# Altium project 语音识别.PrjPcb
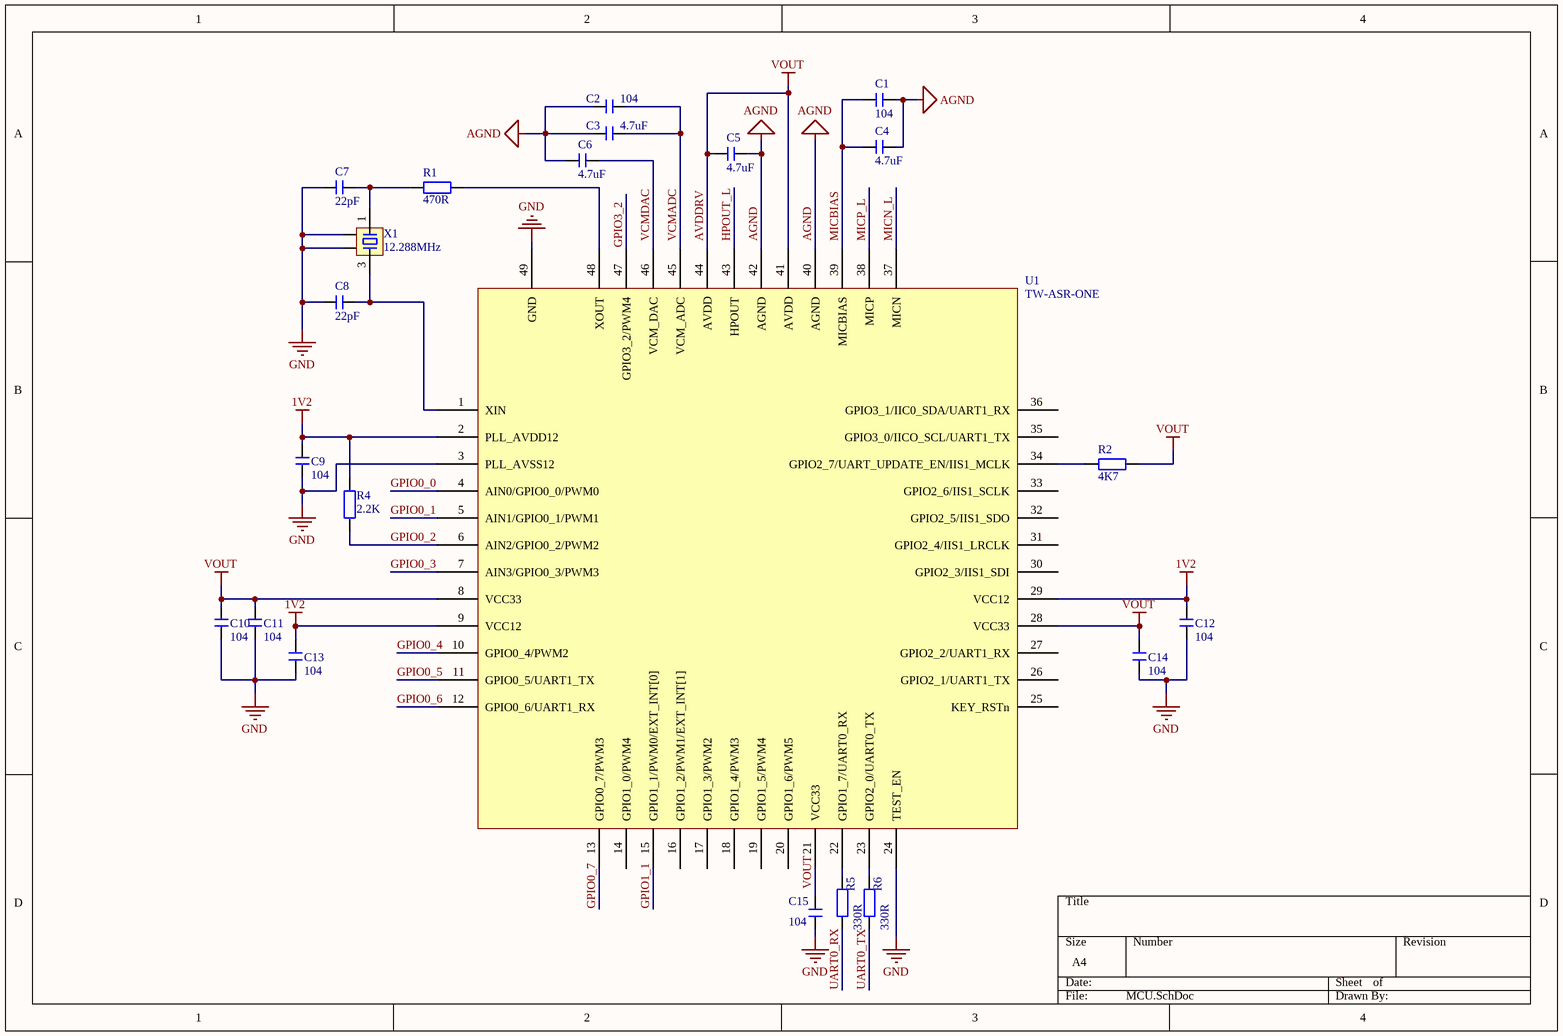
[diagram p0: MCU.SchDoc]
2 sheets, 70 parts. Net scope: global (net labels, ports and power ports of the same name join across sheets).
Board file: PCB.PcbDoc
Sheets:
  MCU.SchDoc
  OTHER.SchDoc

## Sheet MCU.SchDoc
size A4; SheetNumber: 1; SheetTotal: 2

### Parts
C1  104  [C 0603_L]
C2  104  [C 0603_L]
C3  4.7uF  [C 0603_L]
C4  4.7uF  [C 0603_L]
C5  4.7uF  [C 0603_L]
C6  4.7uF  [C 0603_L]
C7  22pF  [C 0603_L]
C8  22pF  [C 0603_L]
C9  104  [C 0603_L]
C10  104  [C 0603_L]
C11  104  [C 0603_L]
C12  104  [C 0603_L]
C13  104  [C 0603_L]
C14  104  [C 0603_L]
C15  104  [C 0603_L]
R1  470R  [R 0603_L]
R2  4K7  [R 0603_L]
R4  2.2K  [R 0603_L]
R5  330R  [R 0603_L]
R6  330R  [R 0603_L]
U1  TW-ASR-ONE  [QFN48 6X6]
X1  12.288MHz  [OSC 3225-4P]

### Nets
1V2: C9.2 C12.2 C13.2 R4.2 U1.2(PLL_AVDD12) U1.9(VCC12) U1.29(VCC12)
AGND: C1.2 C2.1 C3.1 C4.2 C5.2 C6.1 U1.40(AGND) U1.42(AGND)
AVDDRV: C5.1 C10.2 C11.2 C14.2 C15.2 R2.2 U1.8(VCC33) U1.21(VCC33) U1.28(VCC33) U1.41(AVDD) U1.44(AVDD)  [also labelled VOUT]
GND: C7.1 C8.1 C9.1 C10.1 C11.1 C12.1 C13.1 C14.1 C15.1 U1.3(PLL_AVSS12) U1.24(TEST_EN) U1.49(GND) X1.2 X1.4
GPIO0_0: U1.4(AIN0/GPIO0_0/PWM0)
GPIO0_1: U1.5(AIN1/GPIO0_1/PWM1)
GPIO0_2: R4.1 U1.6(AIN2/GPIO0_2/PWM2)
GPIO0_3: U1.7(AIN3/GPIO0_3/PWM3)
GPIO0_4: U1.10(GPIO0_4/PWM2)
GPIO0_5: U1.11(GPIO0_5/UART1_TX)
GPIO0_6: U1.12(GPIO0_6/UART1_RX)
GPIO0_7: U1.13(GPIO0_7/PWM3)
GPIO1_1: U1.15(GPIO1_1/PWM0/EXT_INT[0])
GPIO3_2: U1.47(GPIO3_2/PWM4)
HPOUT_L: U1.43(HPOUT)
MICBIAS: C1.1 C4.1 U1.39(MICBIAS)
MICN_L: U1.37(MICN)
MICP_L: U1.38(MICP)
UART0_RX: R5.1
UART0_TX: R6.1
VCMADC: C2.2 C3.2 U1.45(VCM_ADC)
VCMDAC: C6.2 U1.46(VCM_DAC)
NetC7_2: C7.2 R1.1 X1.1
NetC8_2: C8.2 U1.1(XIN) X1.3
NetR1_2: R1.2 U1.48(XOUT)
NetR2_1: R2.1 U1.34(GPIO2_7/UART_UPDATE_EN/IIS1_MCLK)
NetR5_2: R5.2 U1.22(GPIO1_7/UART0_RX)
NetR6_2: R6.2 U1.23(GPIO2_0/UART0_TX)

Not connected (* = marked no-connect by the designer): U1 14(GPIO1_0/PWM4) 16(GPIO1_2/PWM1/EXT_INT[1]) 17(GPIO1_3/PWM2) 18(GPIO1_4/PWM3) 19(GPIO1_5/PWM4) 20(GPIO1_6/PWM5) 25(KEY_RSTn) 26(GPIO2_1/UART1_TX) 27(GPIO2_2/UART1_RX) 30(GPIO2_3/IIS1_SDI) 31(GPIO2_4/IIS1_LRCLK) 32(GPIO2_5/IIS1_SDO) 33(GPIO2_6/IIS1_SCLK) 35(GPIO3_0/IICO_SCL/UART1_TX) 36(GPIO3_1/IIC0_SDA/UART1_RX)

### Library data of the parts
C1-C15 = C: 无极性贴片电容; 版权归属: 源创客; BOM名称: 无极性贴片电容; 学习资源: www.ooocke.com
R1 R2 R4-R6 = R: 贴片电阻; 版权归属: 源创客; BOM名称: 贴片电阻; 学习资源: www.ooocke.com
X1 = XTAL-4P: 4脚无源晶振; 版权归属: 源创客; BOM名称: 4脚无源晶振; 学习资源: www.ooocke.com

## Sheet OTHER.SchDoc
size A4; SheetNumber: 2; SheetTotal: 2
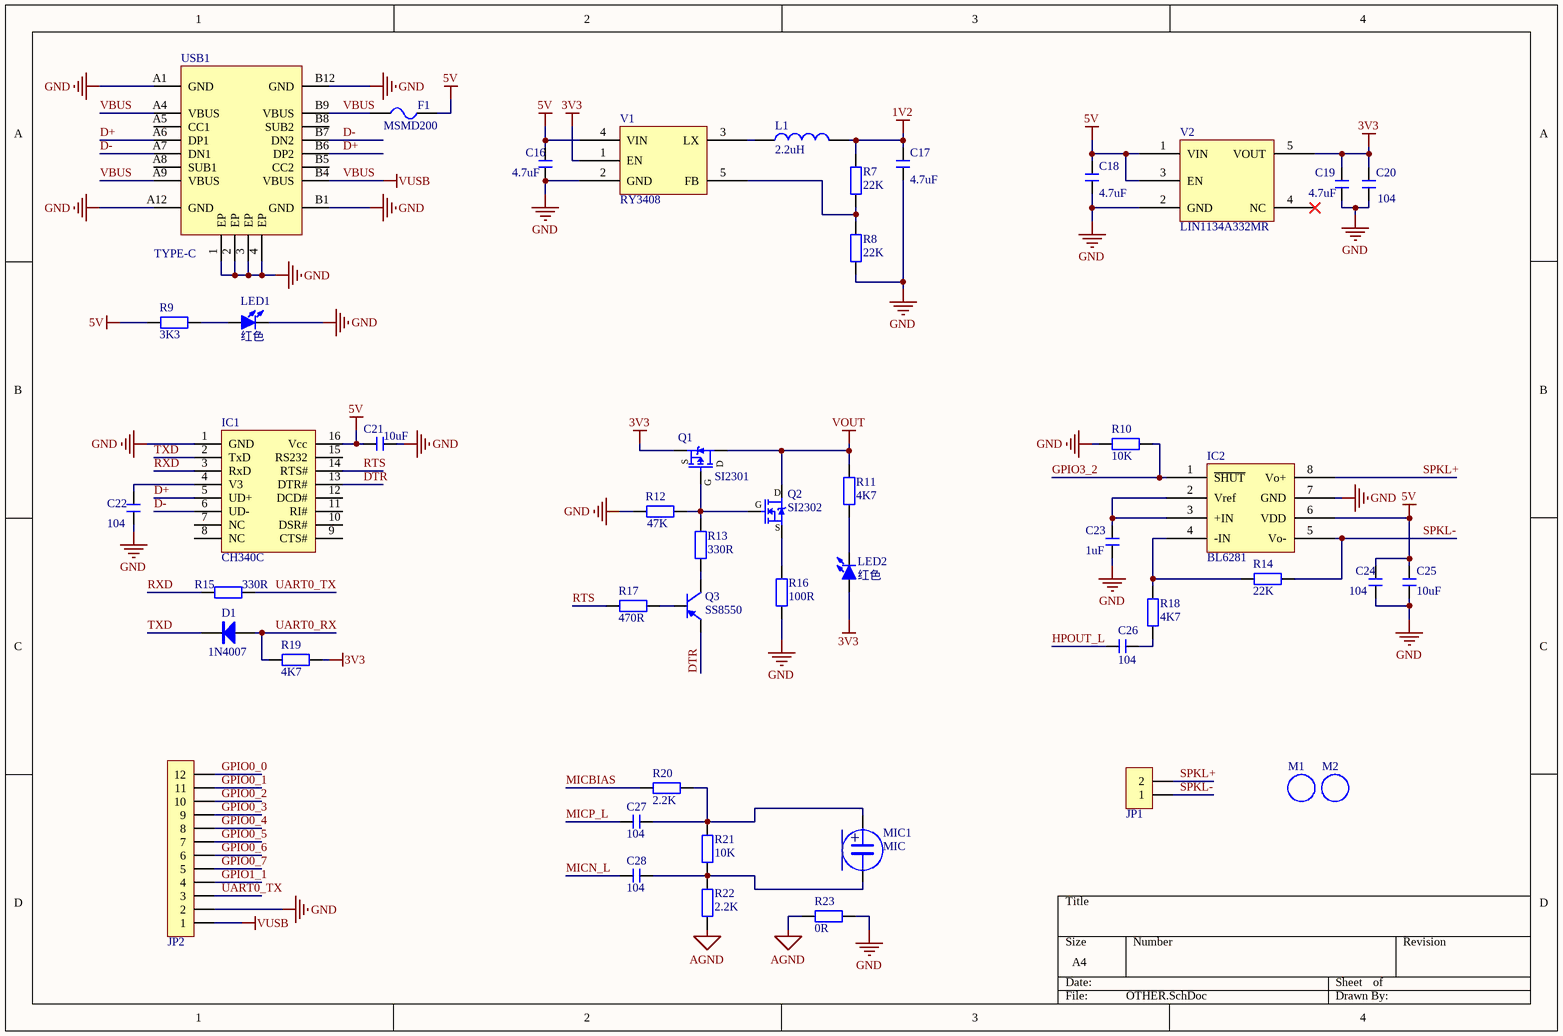
[diagram p1: OTHER.SchDoc]

### Parts
C16  4.7uF  [C 0603_L]
C17  4.7uF  [C 0603_L]
C18  4.7uF  [C 0603_L]
C19  4.7uF  [C 0603_L]
C20  104  [C 0603_L]
C21  10uF  [C 0805_L]
C22  104  [C 0603_L]
C23  1uF  [C 0603_L]
C24  104  [C 0603_L]
C25  10uF  [C 0603_L]
C26  104  [C 0603_L]
C27  104  [C 0603_L]
C28  104  [C 0603_L]
D1  1N4007  [SOD-123]
F1  MSMD200  [FU 0805]
IC1  CH340C  [SOP16_L]
IC2  BL6281  [SOP8_L]
JP1  HDR-1X2  [PH2.0-WS-2P]  (value not drawn)
JP2  HDR-1X12  [HDR2.54-LI-12P]  (value not drawn)
L1  2.2uH  [L 0805]
LED1  红色  [LED 0603R]
LED2  红色  [LED 0603R]
M1  (no value)  [M3 125X200]
M2  (no value)  [M3 125X200]
MIC1  MIC  [MIC-6*2.7]
Q1  SI2301  [SOT23-3N]
Q2  SI2302  [SOT23-3N]
Q3  SS8550  [SOT23-3N]
R7  22K  [R 0603_L]
R8  22K  [R 0603_L]
R9  3K3  [R 0603_L]
R10  10K  [R 0603_L]
R11  4K7  [R 0603_L]
R12  47K  [R 0603_L]
R13  330R  [R 0603_L]
R14  22K  [R 0603_L]
R15  330R  [R 0603_L]
R16  100R  [R 0603_L]
R17  470R  [R 0603_L]
R18  4K7  [R 0603_L]
R19  4K7  [R 0603_L]
R20  2.2K  [R 0603_L]
R21  10K  [R 0603_L]
R22  2.2K  [R 0603_L]
R23  0R  [R 0603_L]
USB1  TYPE-C  [TYPE-C_16P]
V1  RY3408  [SOT23-5N]
V2  LIN1134A332MR  [SOT23-5L]

### Nets
1V2: C17.2 L1.2 R7.2
3V3: C19.2 C20.2 LED2.1(A) Q1.2(S) R19.1 V1.1(EN) V2.5(VOUT)
5V: C16.2 C18.2 C21.2 C24.1 C25.2 F1.2 IC1.16(Vcc) IC2.6(VDD) R9.1 V1.4(VIN) V2.1(VIN) V2.3(EN)
AGND: R22.2 R23.1
GND: C16.1 C17.1 C18.1 C19.1 C20.1 C21.1 C22.1 C23.1 C24.2 C25.1 IC1.1(GND) IC2.7(GND) JP2.2 LED1.2(K) R8.1 R10.2 R12.2 R16.2 R23.2 USB1.1(EP) USB1.2(EP) USB1.3(EP) USB1.4(EP) USB1.A1(GND) USB1.A12(GND) USB1.B1(GND) USB1.B12(GND) V1.2(GND) V2.2(GND)
VBUS: F1.1 JP2.1 USB1.A4(VBUS) USB1.A9(VBUS) USB1.B4(VBUS) USB1.B9(VBUS)  [also labelled VUSB]
VOUT: Q1.3(D) Q2.3(D) R11.2  [project net AVDDRV]
D+: IC1.5(UD+) USB1.A6(DP1) USB1.B6(DP2)
D-: IC1.6(UD-) USB1.A7(DN1) USB1.B7(DN2)
DTR: IC1.13(DTR#) Q3.2(E)
GPIO0_0: JP2.12
GPIO0_1: JP2.11
GPIO0_2: JP2.10
GPIO0_3: JP2.9
GPIO0_4: JP2.8
GPIO0_5: JP2.7
GPIO0_6: JP2.6
GPIO0_7: JP2.5
GPIO1_1: JP2.4
GPIO3_2: IC2.1(~{SHUT}) R10.1
HPOUT_L: C26.2
MICBIAS: R20.1
MICN_L: C28.1
MICP_L: C27.1
RTS: IC1.14(RTS#) R17.2
RXD: IC1.3(RxD) R15.1
SPKL+: IC2.8(Vo+) JP1.2
SPKL-: IC2.5(Vo-) JP1.1 R14.1
TXD: D1.2(K) IC1.2(TxD)
UART0_RX: D1.1(A) R19.2
UART0_TX: JP2.3 R15.2
NetC22_2: C22.2 IC1.4(V3)
NetC23_2: C23.2 IC2.2(Vref) IC2.3(+IN)
NetC26_1: C26.1 R18.2
NetC27_2: C27.2 MIC1.1 R20.2 R21.1
NetC28_2: C28.2 MIC1.2 R21.2 R22.1
NetIC2_4: IC2.4(-IN) R14.2 R18.1
NetL1_1: L1.1 V1.3(LX)
NetLED1_1: LED1.1(A) R9.2
NetLED2_2: LED2.2(K) R11.1
NetQ1_1: Q1.1(G) Q2.1(G) R12.1 R13.2
NetQ2_2: Q2.2(S) R16.1
NetQ3_1: Q3.1(B) R17.1
NetQ3_3: Q3.3(C) R13.1
NetR7_1: R7.1 R8.2 V1.5(FB)

Not connected (* = marked no-connect by the designer): IC1 7(NC) 8(NC) 9(CTS#) 10(DSR#) 11(RI#) 12(DCD#) 15(RS232); USB1 A5(CC1) A8(SUB1) B5(CC2) B8(SUB2); V2 4(NC)*

### Notes on the sheet
- (in symbol MIC3) +

### Library data of the parts
C16-C28 = C: 无极性贴片电容; 版权归属: 源创客; BOM名称: 无极性贴片电容; 学习资源: www.ooocke.com
D1 = 1N4007: 整流二极管; 版权归属: 源创客; BOM名称: 整流二极管; 学习资源: www.ooocke.com
F1 = FU: 贴片保险丝; 版权归属: 源创客; BOM名称: 贴片保险丝; 学习资源: www.ooocke.com
IC1 = CH340G: 串口转USB; 版权归属: 源创客; BOM名称: 串口转USB; 学习资源: www.ooocke.com
IC2 = BL6281: 音频功放
JP1 = Header 2: 2P接插件; 版权归属: 源创客; BOM名称: 2P接插件; 学习资源: www.ooocke.com
JP2 = Header 12: 12P接插件; 版权归属: 源创客; BOM名称: 12P接插件; 学习资源: www.ooocke.com
L1 = L: 小功率贴片电感; 版权归属: 源创客; BOM名称: 小功率贴片电感; 学习资源: www.ooocke.com
LED1 LED2 = LED-SMD: 贴片LED; 版权归属: 源创客; BOM名称: 贴片LED; 学习资源: www.ooocke.com
M1 M2 = M3: 铜柱孔; 版权归属: 源创客; BOM名称: 铜柱孔; 学习资源: www.ooocke.com
MIC1 = MIC3: 麦克风
Q1 = SI2301: P沟道 20V/2.8A; BOM名称: 场效应管; 版权归属: 源创客; 学习资源: www.ooocke.com; 描述: P沟道 20V/2.8A
Q2 = SI2302: N沟道 20V/3A; BOM名称: 场效应管; 版权归属: 源创客; 学习资源: www.ooocke.com; 描述: N沟道 20V/3A
Q3 = 8550-SMD: 高频放大-PNP型; 版权归属: 源创客; 属性: 40V 1.5A 1W 100MHZ; BOM名称: 高频放大-PNP型; 学习资源: www.ooocke.com
R7-R23 = R: 贴片电阻; 版权归属: 源创客; BOM名称: 贴片电阻; 学习资源: www.ooocke.com
USB1 = TYPE-C_16P: 16脚TYPE-C母座
V1 = RY3408: DC电源芯片
V2 = LIN1134A332MR: DC稳压芯片

## Nets that join several sheets
1V2: MCU (7 pins), OTHER (C17.2 L1.2 R7.2)
AGND: MCU (8 pins), OTHER (R22.2 R23.1)
AVDDRV: MCU (11 pins), OTHER (Q1.3 Q2.3 R11.2)
GND: MCU (14 pins), OTHER (29 pins)
GPIO0_0: MCU (U1.4), OTHER (JP2.12)
GPIO0_1: MCU (U1.5), OTHER (JP2.11)
GPIO0_2: MCU (R4.1 U1.6), OTHER (JP2.10)
GPIO0_3: MCU (U1.7), OTHER (JP2.9)
GPIO0_4: MCU (U1.10), OTHER (JP2.8)
GPIO0_5: MCU (U1.11), OTHER (JP2.7)
GPIO0_6: MCU (U1.12), OTHER (JP2.6)
GPIO0_7: MCU (U1.13), OTHER (JP2.5)
GPIO1_1: MCU (U1.15), OTHER (JP2.4)
GPIO3_2: MCU (U1.47), OTHER (IC2.1 R10.1)
HPOUT_L: MCU (U1.43), OTHER (C26.2)
MICBIAS: MCU (C1.1 C4.1 U1.39), OTHER (R20.1)
MICN_L: MCU (U1.37), OTHER (C28.1)
MICP_L: MCU (U1.38), OTHER (C27.1)
UART0_RX: MCU (R5.1), OTHER (D1.1 R19.2)
UART0_TX: MCU (R6.1), OTHER (JP2.3 R15.2)